# EAGLE schematic 2bitAdder (EAGLE 7.4.0)
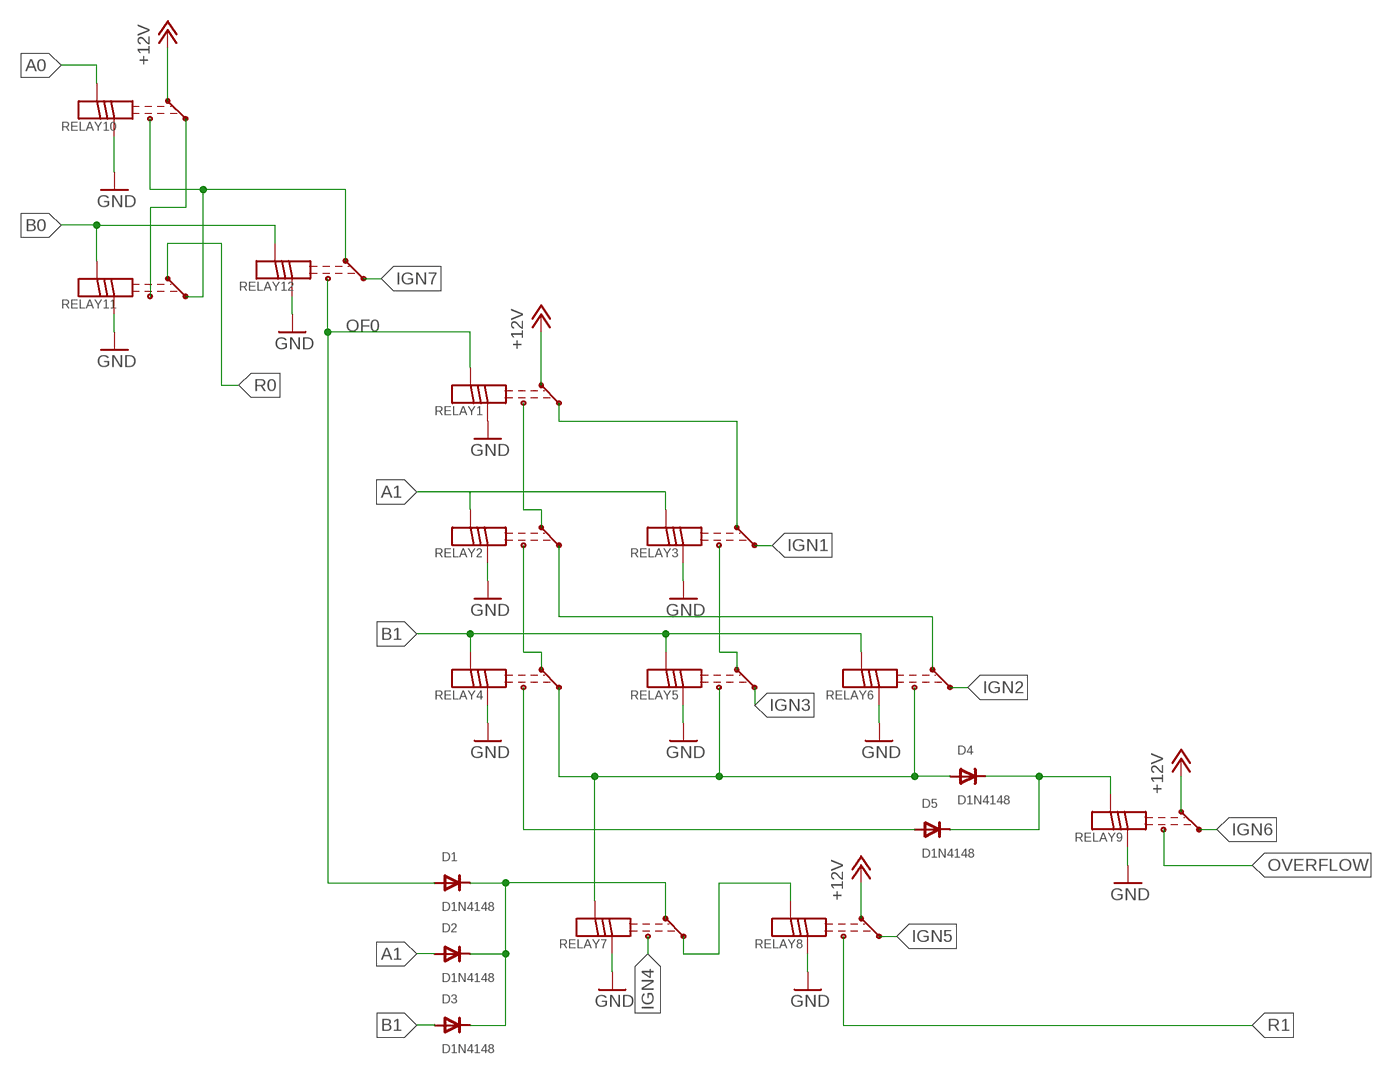
[diagram p0: schematic, sheet 1]

## Parts
D1  D1N4148  DIODE  [R0603]
D2  D1N4148  DIODE  [R0603]
D3  D1N4148  DIODE  [R0603]
D4  D1N4148  DIODE  [R0603]
D5  D1N4148  DIODE  [R0603]
RELAY1  basicRelay  RELAY-GENERIC  [RELAY-FINDER-40.51]
RELAY2  basicRelay  RELAY-GENERIC  [RELAY-FINDER-40.51]
RELAY3  basicRelay  RELAY-GENERIC  [RELAY-FINDER-40.51]
RELAY4  basicRelay  RELAY-GENERIC  [RELAY-FINDER-40.51]
RELAY5  basicRelay  RELAY-GENERIC  [RELAY-FINDER-40.51]
RELAY6  basicRelay  RELAY-GENERIC  [RELAY-FINDER-40.51]
RELAY7  basicRelay  RELAY-GENERIC  [RELAY-FINDER-40.51]
RELAY8  basicRelay  RELAY-GENERIC  [RELAY-FINDER-40.51]
RELAY9  basicRelay  RELAY-GENERIC  [RELAY-FINDER-40.51]
RELAY10  basicRelay  RELAY-GENERIC  [RELAY-FINDER-40.51]
RELAY11  basicRelay  RELAY-GENERIC  [RELAY-FINDER-40.51]
RELAY12  basicRelay  RELAY-GENERIC  [RELAY-FINDER-40.51]

## Nets
+12V: RELAY1.CENTER RELAY8.CENTER RELAY9.CENTER RELAY10.CENTER
A0: RELAY10.N+
A1: D2.1(ANODE) RELAY2.N+ RELAY3.N+
B0: RELAY11.N+ RELAY12.N+
B1: D3.1(ANODE) RELAY4.N+ RELAY5.N+ RELAY6.N+
GND: RELAY1.N- RELAY2.N- RELAY3.N- RELAY4.N- RELAY5.N- RELAY6.N- RELAY7.N- RELAY8.N- RELAY9.N- RELAY10.N- RELAY11.N- RELAY12.N-
IGN1: RELAY3.NCL
IGN2: RELAY6.NCL
IGN3: RELAY5.NCL
IGN4: RELAY7.NOP
IGN5: RELAY8.NCL
IGN6: RELAY9.NCL
IGN7: RELAY12.NCL
N$1: RELAY1.NOP RELAY2.CENTER
N$2: RELAY2.NOP RELAY4.CENTER
N$3: RELAY3.NOP RELAY5.CENTER
N$4: RELAY1.NCL RELAY3.CENTER
N$5: RELAY10.NOP RELAY11.NCL RELAY12.CENTER
N$6: D5.1(ANODE) RELAY4.NOP
N$7: D4.2(CATHODE) D5.2(CATHODE) RELAY9.N+
N$8: RELAY2.NCL RELAY6.CENTER
N$9: D4.1(ANODE) RELAY4.NCL RELAY5.NOP RELAY6.NOP RELAY7.N+
N$10: D1.2(CATHODE) D2.2(CATHODE) D3.2(CATHODE) RELAY7.CENTER
N$11: RELAY7.NCL RELAY8.N+
N$12: RELAY10.NCL RELAY11.NOP
OF0: D1.1(ANODE) RELAY1.N+ RELAY12.NOP
OVERFLOW: RELAY9.NOP
R0: RELAY11.CENTER
R1: RELAY8.NOP

## Library data of the parts
D1-D5 = p.peter-scoville.tests:DIODE; SV_SPICE_MODEL: D (IS=0.1PA, RS=16 CJO=2PF TT=12N BV=100 IBV=0.1PA); SV_SPICE_ORDER: ANODE;CATHODE; SV_SPICE_PREFIX: D
RELAY1-RELAY12 = p.peter-scoville.tests:RELAY-GENERIC; SV_SPICE_ORDER: NOP;CENTER;NCL;N+;N-; SV_SPICE_PREFIX: x; SV_SPICE_SUBCKT: .subckt %NAME% 1 2 3 4 5\nSOpen 1 2 4 5 SW_OPEN on\nSClosed 2 3 4 5 SW_CLOSED on\n* Some pulldowns, to make sure nothing is floating\nR1 1 GND 10k\nR2 2 GND 10k\nR3 3 GND 10k\nR4 4 GND 10k\nR5 5 GND 10k\n.model SW_OPEN SW(Ron=.1 Roff=1Meg Vt=6 )\n.model SW_CLOSED SW(Ron=1Meg Roff=.1 Vt=6 )\n.ends